# Altium schematic sheet Main.SchDoc
size A
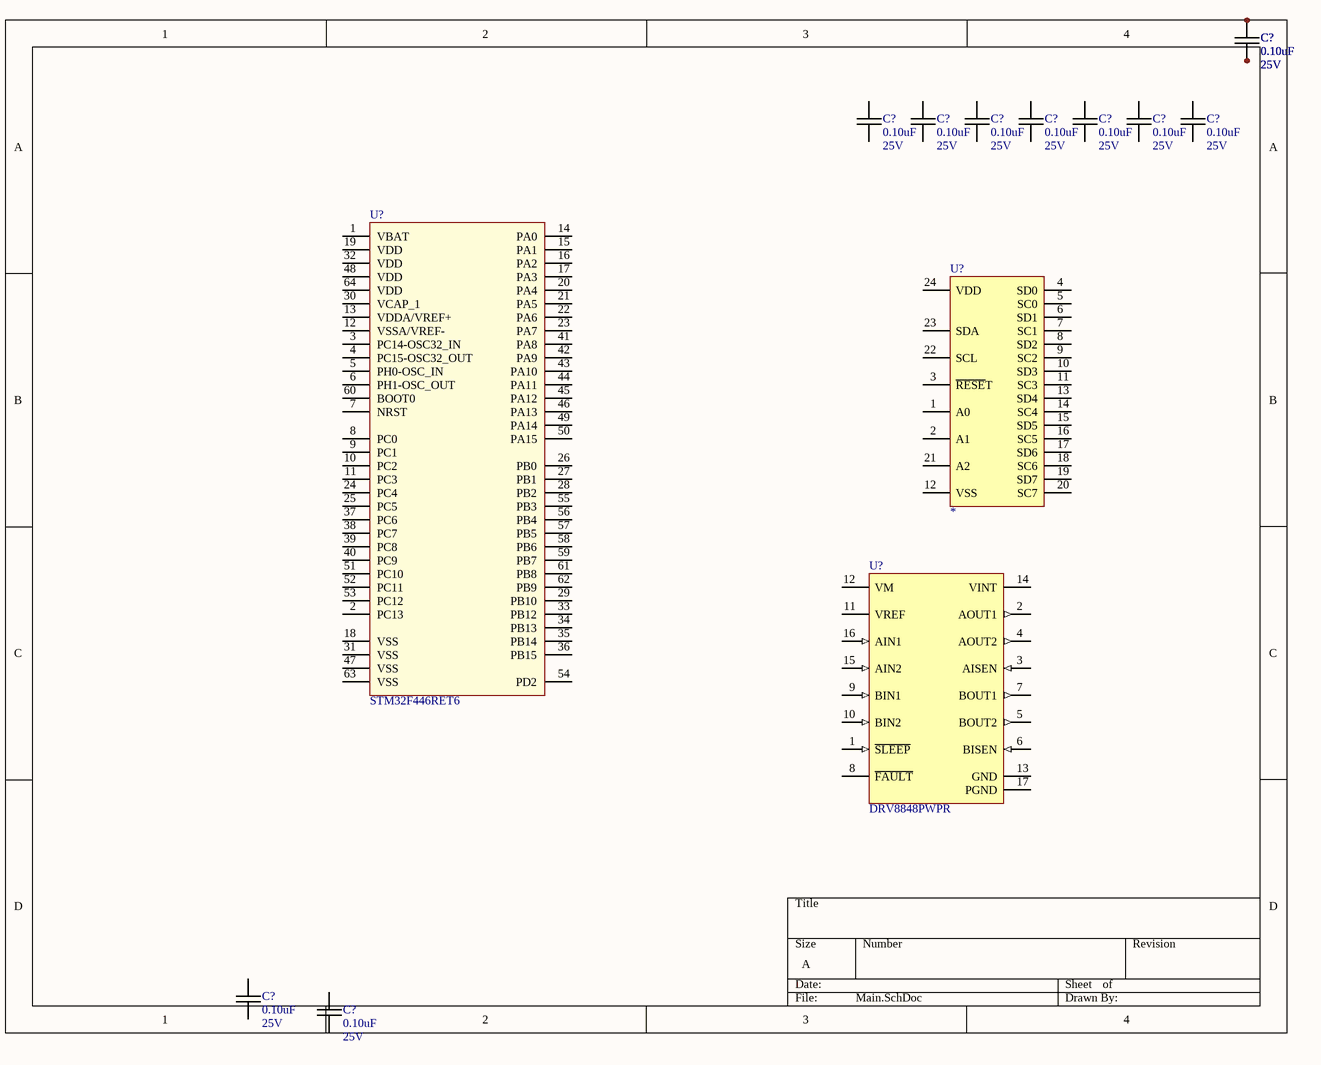
[diagram p0: Main.SchDoc]

## Parts
(Parts that share a designator on the sheet are numbered #1, #2 ... from top to bottom, then left to right.)
C?#1  Capacitance: 0.10uF  Voltage Rating: 25V  [chip_0805]  (hidden comment: cap_single_np)
C?#2  Capacitance: 0.10uF  Voltage Rating: 25V  [chip_0805]  (hidden comment: cap_single_np)
C?#3  Capacitance: 0.10uF  Voltage Rating: 25V  [chip_0805]  (hidden comment: cap_single_np)
C?#4  Capacitance: 0.10uF  Voltage Rating: 25V  [chip_0805]  (hidden comment: cap_single_np)
C?#5  Capacitance: 0.10uF  Voltage Rating: 25V  [chip_0805]  (hidden comment: cap_single_np)
C?#6  Capacitance: 0.10uF  Voltage Rating: 25V  [chip_0805]  (hidden comment: cap_single_np)
C?#7  Capacitance: 0.10uF  Voltage Rating: 25V  [chip_0805]  (hidden comment: cap_single_np)
C?#8  Capacitance: 0.10uF  Voltage Rating: 25V  [chip_0805]  (hidden comment: cap_single_np)
C?#9  Capacitance: 0.10uF  Voltage Rating: 25V  [chip_0805]  (hidden comment: cap_single_np)
C?#10  Capacitance: 0.10uF  Voltage Rating: 25V  [chip_0805]  (hidden comment: cap_single_np)
C?#11  Capacitance: 0.10uF  Voltage Rating: 25V  [chip_0805]  (hidden comment: cap_single_np)
C?#12  Capacitance: 0.10uF  Voltage Rating: 25V  [chip_0805]  (hidden comment: cap_single_np)
U?#1  Manufacturer PN: STM32F446RET6  [LQFP64_0]  (hidden comment: STM32F446_64_0)
U?#2  TCA9548A  [tssop-24_0]  (value not drawn)
U?#3  Manufacturer PN: DRV8848PWPR  [HTSSOP-16_0]  (hidden comment: DRV8848)

## Nets
NetC?#1_1: C?#1.1 C?#2.1 C?#3.1
NetC?#1_2: C?#1.2 C?#2.2 C?#3.2

Not connected (* = marked no-connect by the designer): C?#4 1 2; C?#5 1 2; C?#6 1 2; C?#7 1 2; C?#8 1 2; C?#9 1 2; C?#10 1 2; C?#11 1 2; C?#12 1 2; U?#1 1(VBAT) 2(PC13) 3(PC14-OSC32_IN) 4(PC15-OSC32_OUT) 5(PH0-OSC_IN) 6(PH1-OSC_OUT) 7(NRST) 8(PC0) 9(PC1) 10(PC2) 11(PC3) 12(VSSA/VREF-) 13(VDDA/VREF+) 14(PA0) 15(PA1) 16(PA2) 17(PA3) 18(VSS) 19(VDD) 20(PA4) 21(PA5) 22(PA6) 23(PA7) 24(PC4) 25(PC5) 26(PB0) 27(PB1) 28(PB2) 29(PB10) 30(VCAP_1) 31(VSS) 32(VDD) 33(PB12) 34(PB13) 35(PB14) 36(PB15) 37(PC6) 38(PC7) 39(PC8) 40(PC9) 41(PA8) 42(PA9) 43(PA10) 44(PA11) 45(PA12) 46(PA13) 47(VSS) 48(VDD) 49(PA14) 50(PA15) 51(PC10) 52(PC11) 53(PC12) 54(PD2) 55(PB3) 56(PB4) 57(PB5) 58(PB6) 59(PB7) 60(BOOT0) 61(PB8) 62(PB9) 63(VSS) 64(VDD); U?#2 1(A0) 2(A1) 3(~{RESE}T) 4(SD0) 5(SC0) 6(SD1) 7(SC1) 8(SD2) 9(SC2) 10(SD3) 11(SC3) 12(VSS) 13(SD4) 14(SC4) 15(SD5) 16(SC5) 17(SD6) 18(SC6) 19(SD7) 20(SC7) 21(A2) 22(SCL) 23(SDA) 24(VDD); U?#3 1(~{SLEEP}) 2(AOUT1) 3(AISEN) 4(AOUT2) 5(BOUT2) 6(BISEN) 7(BOUT1) 8(~{FAULT}) 9(BIN1) 10(BIN2) 11(VREF) 12(VM) 13(GND) 14(VINT) 15(AIN2) 16(AIN1) 17(PGND)

## Library data of the parts
C?#1-C?#12 = CAP-00071: CAP, 0.10uF, 10%, 25V, X7R, 0805; Manufacturer: Murata; Manufacturer PN: GRM21BR71E104KA01L; Tolerance: 10%; Part Number: CAP-00071; Type: X7R
U?#1 = UCTRL-00002: STM32F4 Series, 32-bit ARM M4, 180MHz, LQFP64; Manufacturer: ST; Part Number: UCTRL-00002
U?#2 = IFACE-00001: I2C 8-Channel Mux with Reset, TCA9548A; Manufacturer: TI; Manufacture PN: *; Part Number: IFACE-00001; Manufacturer PN: TCA9548A; Cost: 1.55
U?#3 = MISC-00022: IC, Motor Driver, Quad Half-Bridge, 4-18V; Manufacturer: TI; Part Number: MISC-00022; Cost: 1.53